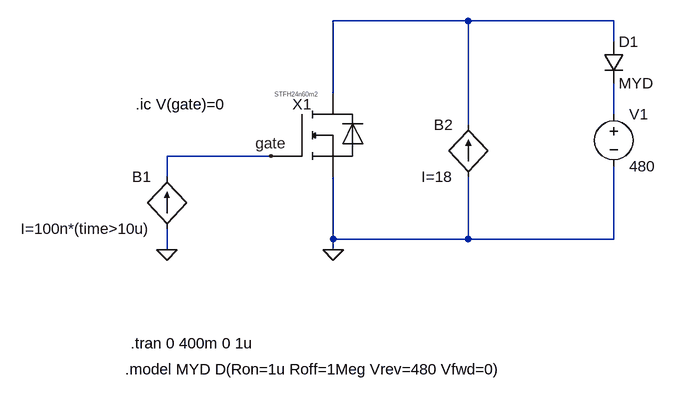
[diagram p0: schematic STFH24N60M2_test_cap.asc]
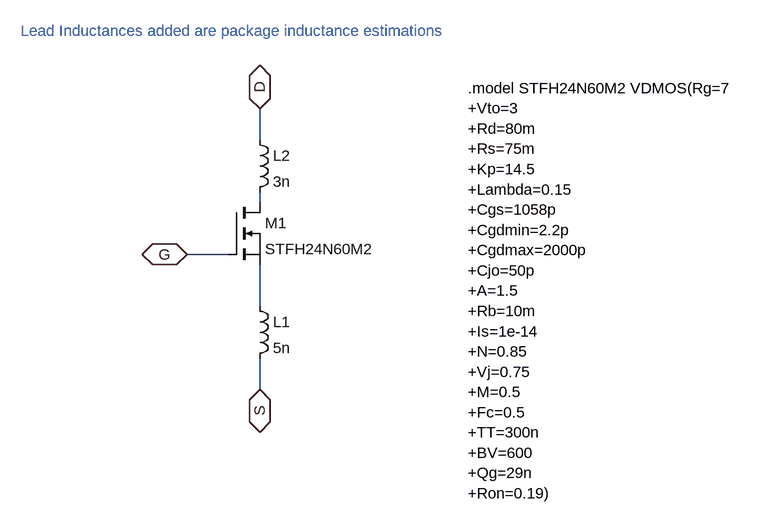
[diagram p1: sub-circuit stfh24n60m2.asc]
STFH24N60M2_test_cap.asc, the LTspice schematic file:
Version 4.1
SHEET 1 880 996
WIRE 560 0 352 0
WIRE 784 0 560 0
WIRE 784 32 784 0
WIRE 352 112 352 0
WIRE 784 144 784 96
WIRE 560 160 560 0
WIRE 256 208 96 208
WIRE 96 240 96 208
WIRE 352 336 352 240
WIRE 560 336 560 240
WIRE 560 336 352 336
WIRE 784 336 784 224
WIRE 784 336 560 336
WIRE 96 352 96 320
WIRE 352 352 352 336
FLAG 352 352 0
FLAG 96 352 0
FLAG 256 208 gate
SYMBOL STFH24N60M2 432 176 R0
SYMATTR InstName X1
SYMBOL voltage 784 128 R0
WINDOW 123 0 0 Left 0
WINDOW 39 0 0 Left 0
SYMATTR InstName V1
SYMATTR Value 480
SYMBOL bi 96 320 R180
WINDOW 0 24 80 Left 2
WINDOW 3 24 0 Left 2
SYMATTR InstName B1
SYMATTR Value I=100n*(time>10u)
SYMBOL bi 560 240 R180
WINDOW 0 24 80 Left 2
WINDOW 3 24 0 Left 2
SYMATTR InstName B2
SYMATTR Value I=18
SYMBOL diode 768 32 R0
SYMATTR InstName D1
SYMATTR Value MYD
TEXT 40 496 Left 2 !.tran 0 400m 0 1u
TEXT 32 536 Left 2 !.model MYD D(Ron=1u Roff=1Meg Vrev=480 Vfwd=0)
TEXT 48 128 Left 2 !.ic V(gate)=0

stfh24n60m2.asc, the sub-circuit schematic file:
Version 4.1
SHEET 1 2968 980
WIRE -256 -144 -256 -192
WIRE -256 -48 -256 -64
WIRE -304 32 -368 32
WIRE -256 112 -256 48
WIRE -256 240 -256 192
FLAG -256 -192 D
IOPIN -256 -192 BiDir
FLAG -368 32 G
IOPIN -368 32 BiDir
FLAG -256 240 S
IOPIN -256 240 BiDir
SYMBOL nmos -304 -48 R0
SYMATTR InstName M1
SYMATTR Value STFH24N60M2
SYMBOL ind -272 96 R0
SYMATTR InstName L1
SYMATTR Value 5n
SYMATTR SpiceLine Cpar=10p
SYMBOL ind -272 -160 R0
SYMATTR InstName L2
SYMATTR Value 3n
SYMATTR SpiceLine Cpar=10p
TEXT -624 -312 Left 2 ;Lead Inductances added are package inductance estimations
TEXT 64 -224 Left 2 !.model STFH24N60M2 VDMOS(Rg=7 \n+Vto=3\n+Rd=80m\n+Rs=75m\n+Kp=14.5\n+Lambda=0.15\n+Cgs=1058p\n+Cgdmin=2.2p\n+Cgdmax=2000p\n+Cjo=50p\n+A=1.5\n+Rb=10m\n+Is=1e-14\n+N=0.85\n+Vj=0.75\n+M=0.5\n+Fc=0.5\n+TT=300n\n+BV=600\n+Qg=29n\n+Ron=0.19)

The netlist it stands for:
* STFH24N60M2_test_cap.asc
X§X1 N001 gate 0 stfh24n60m2
V1 N002 0 480
B1 0 gate I=100n*(time>10u)
B2 0 N001 I=18
D1 N001 N002 MYD

* block symbol definitions
.subckt stfh24n60m2 D G S
M1 N001 G N002 N002 STFH24N60M2
L1 N002 S 5n Cpar=10p
L2 D N001 3n Cpar=10p
* Lead Inductances added are package inductance estimations
.model STFH24N60M2 VDMOS(Rg=7
+Vto=3
+Rd=80m
+Rs=75m
+Kp=14.5
+Lambda=0.15
+Cgs=1058p
+Cgdmin=2.2p
+Cgdmax=2000p
+Cjo=50p
+A=1.5
+Rb=10m
+Is=1e-14
+N=0.85
+Vj=0.75
+M=0.5
+Fc=0.5
+TT=300n
+BV=600
+Qg=29n
+Ron=0.19)
.ends stfh24n60m2

.model D D
.lib standard.dio
.model NMOS NMOS
.model PMOS PMOS
.lib standard.mos
.tran 0 400m 0 1u
.model MYD D(Ron=1u Roff=1Meg Vrev=480 Vfwd=0)
.ic V(gate)=0
.backanno
.end